# EAGLE design zone_ctrl (EAGLE 9.6.2)
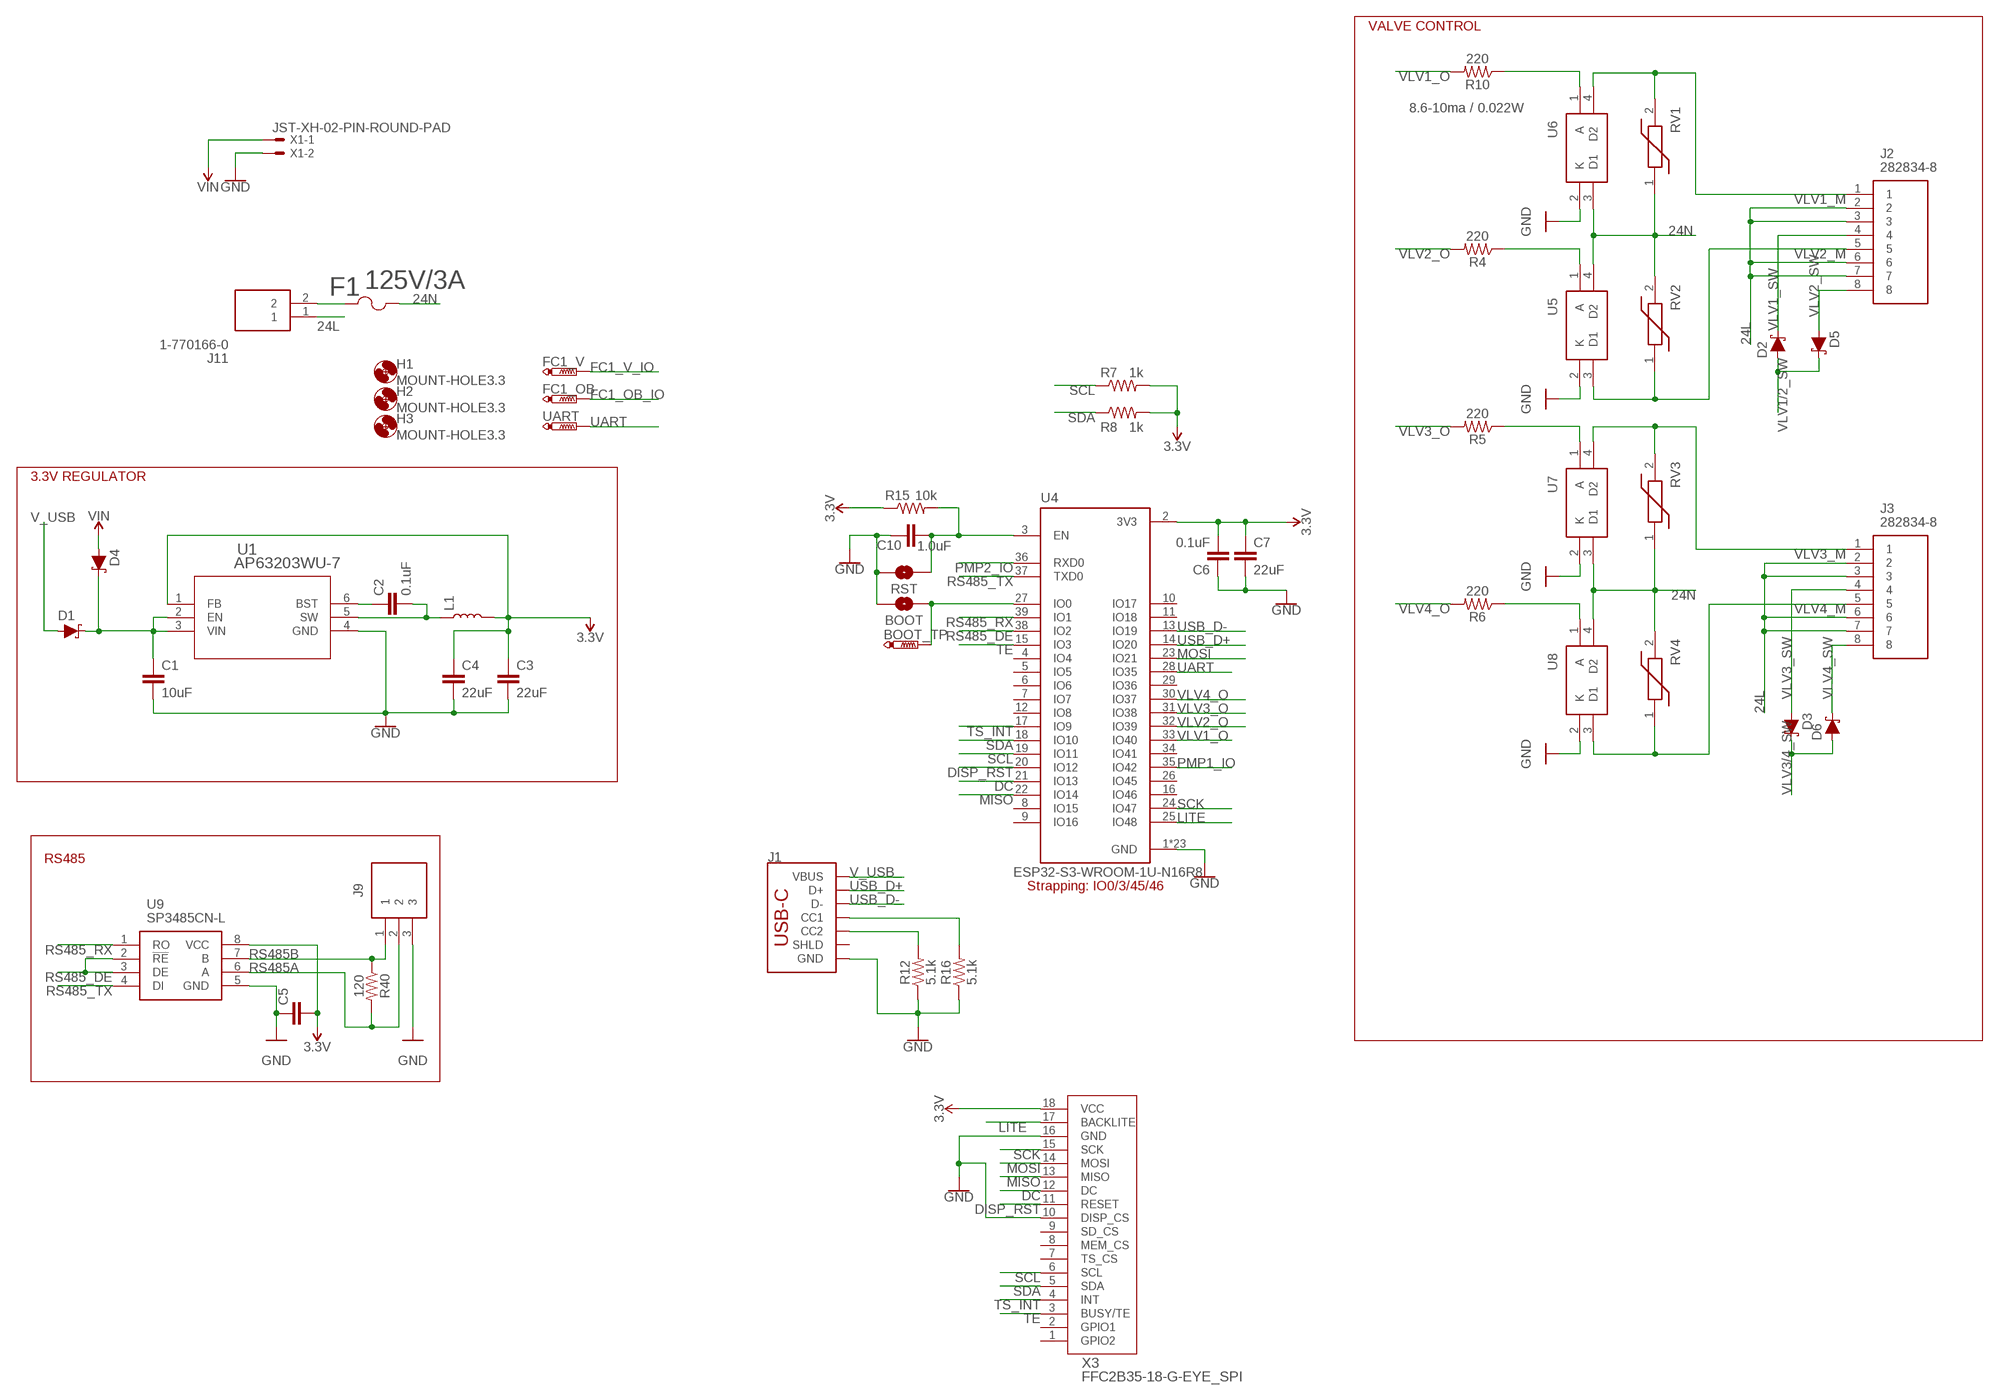
[diagram p0: schematic, sheet 1, part 1 of 2]
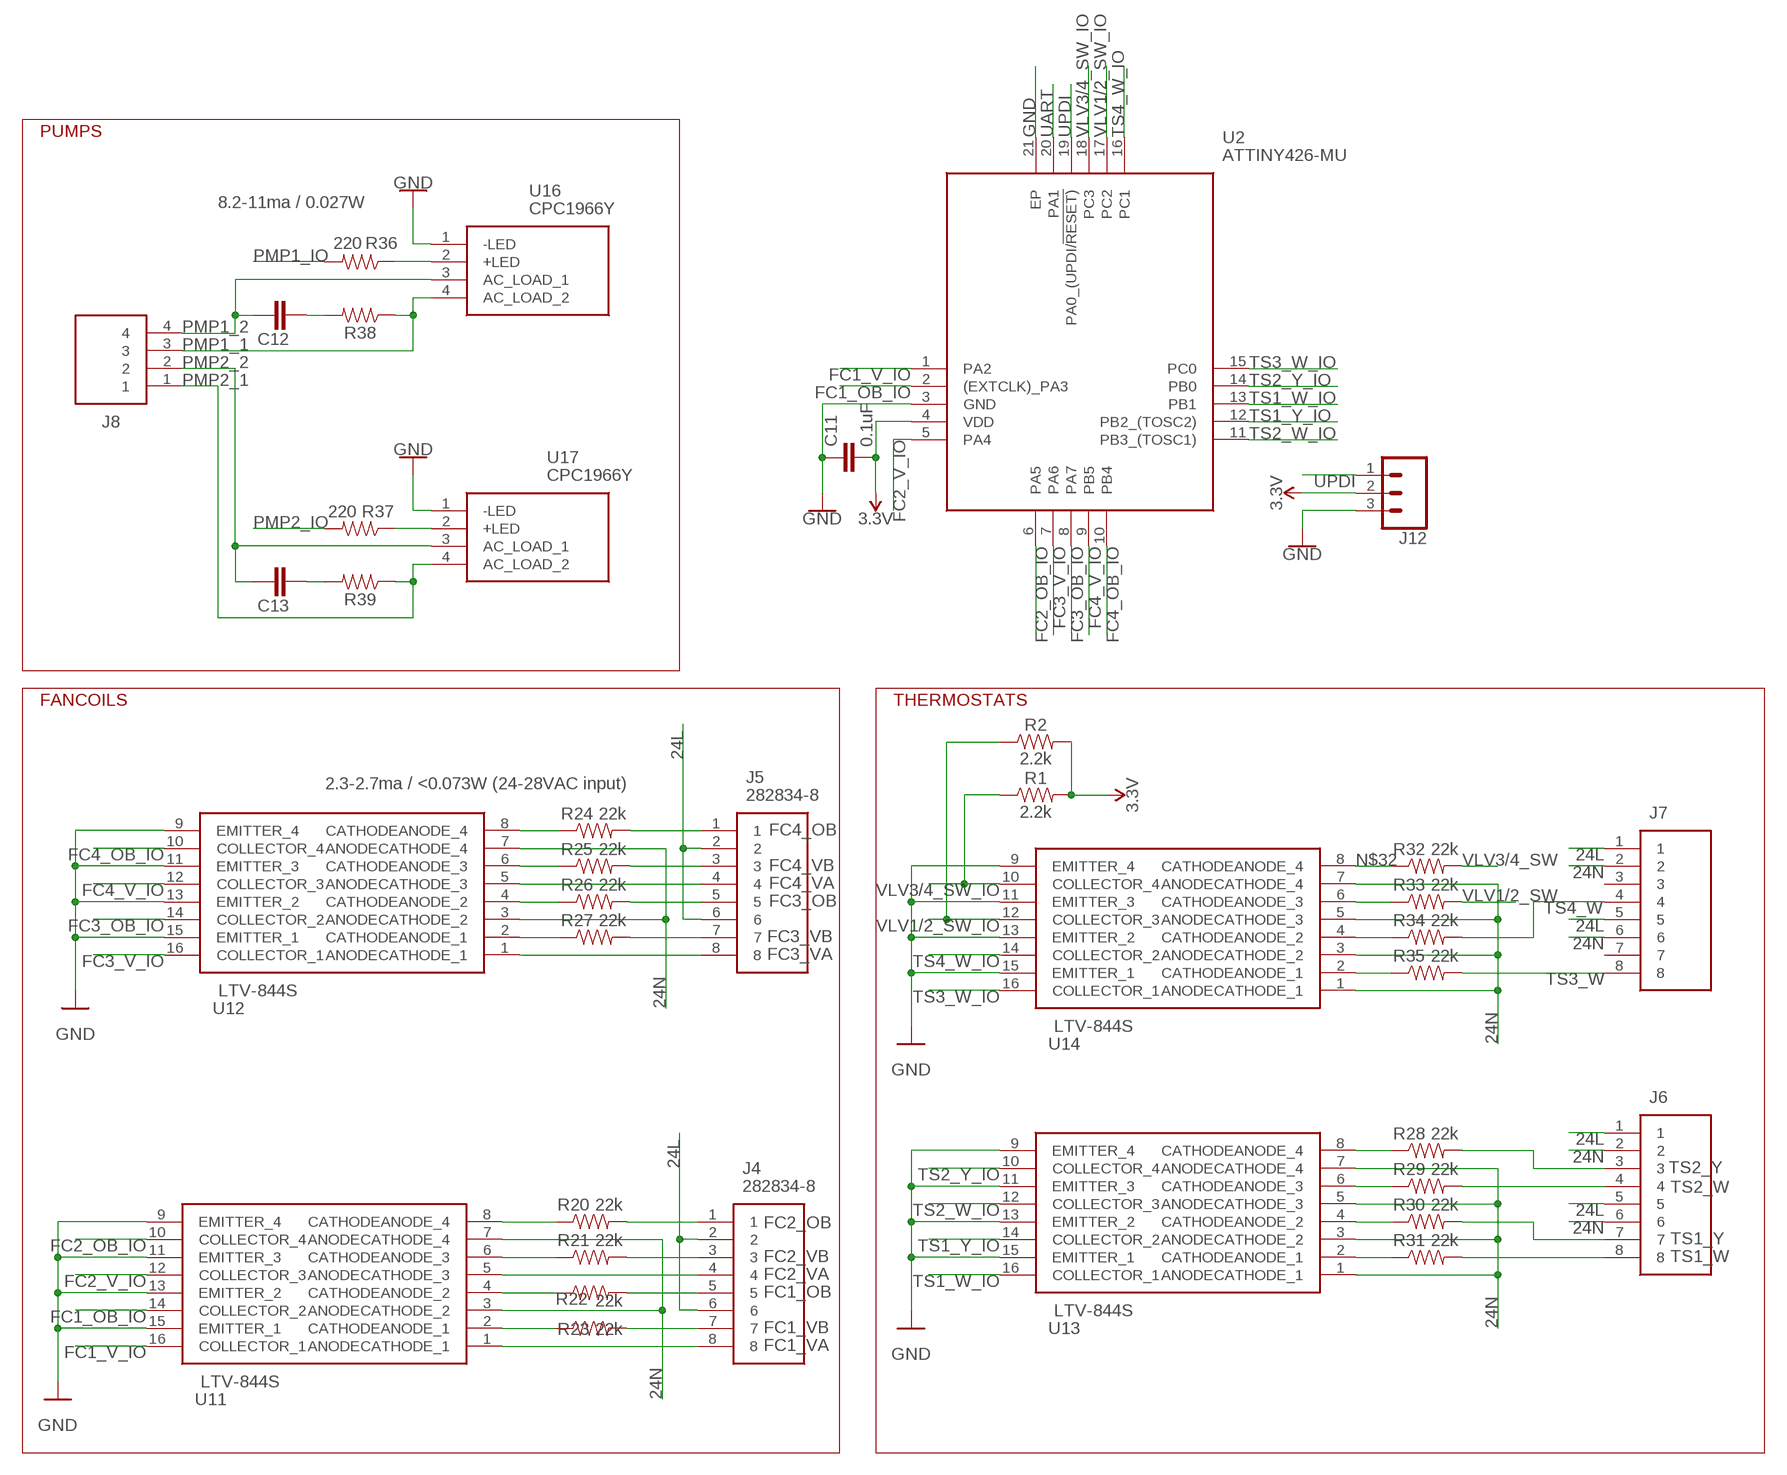
[diagram p1: schematic, sheet 1, part 2 of 2]

## Parts
BOOT  JUMPER-SMT_2_NO_NO-SILK  [SMT-JUMPER_2_NO_NO-SILK]
BOOT_TP  PTR1B1,27  [B1,27]
C1  10uF  10UF-1206-6.3V-20%  [1206]
C2  0.1uF  0.1UF-0603-25V-5%  [0603]
C3  22uF  22UF-0805-6.3V-20%  [0805]
C4  22uF  22UF-0805-6.3V-20%  [0805]
C5  0.1uF  0.1UF-0603-25V-5%  [0603]
C6  0.1uF  0.1UF-0603-25V-5%  [0603]
C7  22uF  22UF-0805-6.3V-20%  [0805]
C10  1.0uF  1.0UF-0603-16V-10%  [0603]
C11  0.1uF  0.1UF-0603-25V-5%  [0603]
C12  10nF  10NF-0805-400V-20%  [0805]
C13  10nF  10NF-0805-400V-20%  [0805]
D1  1A/23V/620mV  DIODE-SCHOTTKY-BAT20J  [SOD-323]
D2  1A/23V/620mV  DIODE-SCHOTTKY-BAT20J  [SOD-323]
D3  1A/23V/620mV  DIODE-SCHOTTKY-BAT20J  [SOD-323]
D4  1A/23V/620mV  DIODE-SCHOTTKY-BAT20J  [SOD-323]
D5  1A/23V/620mV  DIODE-SCHOTTKY-BAT20J  [SOD-323]
D6  1A/23V/620mV  DIODE-SCHOTTKY-BAT20J  [SOD-323]
F1  125V/3A  01550900M125V/3A/SLOW  [01550900M]
FC1_OB  PTR1B1,27  [B1,27]
FC1_V  PTR1B1,27  [B1,27]
H1  MOUNT-HOLE3.3  [3,3]
H2  MOUNT-HOLE3.3  [3,3]
H3  MOUNT-HOLE3.3  [3,3]
J1  USB_C_2-LAYER_PADS  [USB-C-16P-2LAYER-PADS]
J2  282834-8  [2828348]
J3  282834-8  [2828348]
J4  282834-8  [2828348]
J5  282834-8  [2828348]
J6  282834-8  [2828348]
J7  282834-8  [2828348]
J8  4DB-P108-04  [SHDR4W132P0X826_1X4_3467X1270X]
J9  282834-3  [2828343]
J11  1-770166-0  [17701660]
J12  455-1750-1-ND  CONN_03  [1X03]
L1  4.7μH_SHIELDED_INDUCTOR  [1008(2520)]
R1  2.2k  2.2KOHM-0603-1/10W-1%  [0603]
R2  2.2k  2.2KOHM-0603-1/10W-1%  [0603]
R4  220  220OHM-0603-1/10W-1%  [0603]
R5  220  220OHM-0603-1/10W-1%  [0603]
R6  220  220OHM-0603-1/10W-1%  [0603]
R7  1k  1KOHM-0603-1/10W-1%  [0603]
R8  1k  1KOHM-0603-1/10W-1%  [0603]
R10  220  220OHM-0603-1/10W-1%  [0603]
R12  5.1k  5.1KOHM5.1KOHM-0603-1/10W-1%  [0603]
R15  10k  10KOHM-0603-1/10W-1%  [0603]
R16  5.1k  5.1KOHM5.1KOHM-0603-1/10W-1%  [0603]
R20  22k  22KOHM-0603-1/10W-1%  [0603]
R21  22k  22KOHM-0603-1/10W-1%  [0603]
R22  22k  22KOHM-0603-1/10W-1%  [0603]
R23  22k  22KOHM-0603-1/10W-1%  [0603]
R24  22k  22KOHM-0603-1/10W-1%  [0603]
R25  22k  22KOHM-0603-1/10W-1%  [0603]
R26  22k  22KOHM-0603-1/10W-1%  [0603]
R27  22k  22KOHM-0603-1/10W-1%  [0603]
R28  22k  22KOHM-0603-1/10W-1%  [0603]
R29  22k  22KOHM-0603-1/10W-1%  [0603]
R30  22k  22KOHM-0603-1/10W-1%  [0603]
R31  22k  22KOHM-0603-1/10W-1%  [0603]
R32  22k  22KOHM-0603-1/10W-1%  [0603]
R33  22k  22KOHM-0603-1/10W-1%  [0603]
R34  22k  22KOHM-0603-1/10W-1%  [0603]
R35  22k  22KOHM-0603-1/10W-1%  [0603]
R36  220  220OHM-0603-1/10W-1%  [0603]
R37  220  220OHM-0603-1/10W-1%  [0603]
R38  100  100OHM-0805-1/10W-5%-400V  [0805]
R39  100  100OHM-0805-1/10W-5%-400V  [0805]
R40  120  120OHM-0603-1/10W-5%  [0603]
RST  JUMPER-SMT_2_NO_NO-SILK  [SMT-JUMPER_2_NO_NO-SILK]
RV1  ZV35K1210251NIR1  [VARC3225X145N]
RV2  ZV35K1210251NIR1  [VARC3225X145N]
RV3  ZV35K1210251NIR1  [VARC3225X145N]
RV4  ZV35K1210251NIR1  [VARC3225X145N]
U1  AP63203WU-7  [SOIC_05WU-7_DIO]
U2  ATTINY426-MU  [QFN40P300X300X90-21N]
U4  ESP32-S3-WROOM-1U-N16R8  [ESP32S3WROOM1UN16R8]
U5  G3VM-61VY3_TR_  [G3VM61VY3TR]
U6  G3VM-61VY3_TR_  [G3VM61VY3TR]
U7  G3VM-61VY3_TR_  [G3VM61VY3TR]
U8  G3VM-61VY3_TR_  [G3VM61VY3TR]
U9  SP3485CN-L  [SOIC127P600X175-8N]
U11  LTV-844S  [LTV846S]
U12  LTV-844S  [LTV846S]
U13  LTV-844S  [LTV846S]
U14  LTV-844S  [LTV846S]
U16  CPC1966Y  [CPC1966Y]
U17  CPC1966Y  [CPC1966Y]
UART  PTR1B1,27  [B1,27]
X1  JST-XH-02-PIN-ROUND-PAD  [JST-XH-02-PACKAGE-ROUND-PAD]
X3  FFC2B35-18-G-EYE_SPI  [FFC2B3518G]

## Nets
3.3V: C3.1 C4.1 C5.2 C6.2 C7.1 C11.2 J12.2 L1.2 R1.2 R2.2 R7.2 R8.2 R15.1 U1.1(FB) U2.4(VDD) U4.2(3V3) U9.8(VCC) X3.18(VCC)
24L [24VAC]: J2.2 J2.3 J2.6 J2.7 J3.2 J3.3 J3.6 J3.7 J4.2 J4.6 J5.2 J5.6 J6.1 J6.5 J7.1 J7.5 J11.1
24N [24VAC]: F1.2 J6.2 J6.6 J7.2 J7.6 RV1.1 RV2.2 RV3.1 RV4.2 U5.4(D2) U6.3(D1) U7.3(D1) U8.4(D2) U11.3(ANODECATHODE_2) U11.7(ANODECATHODE_4) U12.3(ANODECATHODE_2) U12.7(ANODECATHODE_4) U13.1(ANODECATHODE_1) U13.3(ANODECATHODE_2) U13.5(ANODECATHODE_3) U13.7(ANODECATHODE_4) U14.1(ANODECATHODE_1) U14.3(ANODECATHODE_2) U14.5(ANODECATHODE_3) U14.7(ANODECATHODE_4)
DC: U4.21(IO13) X3.12(DC)
DISP_RST: U4.20(IO12) X3.11(RESET)
FC1_OB: J4.5 R22.2
FC1_OB_IO: FC1_OB.TP U2.2((EXTCLK)_PA3) U11.14(COLLECTOR_2)
FC1_V_IO: FC1_V.TP U2.1(PA2) U11.16(COLLECTOR_1)
FC1_VA: J4.8 U11.1(ANODECATHODE_1)
FC1_VB: J4.7 R23.2
FC2_OB: J4.1 R20.2
FC2_OB_IO: U2.6(PA5) U11.10(COLLECTOR_4)
FC2_V_IO: U2.5(PA4) U11.12(COLLECTOR_3)
FC2_VA: J4.4 U11.5(ANODECATHODE_3)
FC2_VB: J4.3 R21.2
FC3_OB: J5.5 R26.2
FC3_OB_IO: U2.8(PA7) U12.14(COLLECTOR_2)
FC3_V_IO: U2.7(PA6) U12.16(COLLECTOR_1)
FC3_VA: J5.8 U12.1(ANODECATHODE_1)
FC3_VB: J5.7 R27.2
FC4_OB: J5.1 R24.2
FC4_OB_IO: U2.10(PB4) U12.10(COLLECTOR_4)
FC4_V_IO: U2.9(PB5) U12.12(COLLECTOR_3)
FC4_VA: J5.4 U12.5(ANODECATHODE_3)
FC4_VB: J5.3 R25.2
GND: BOOT.2 C1.2 C3.2 C4.2 C5.1 C6.1 C7.2 C10.1 C11.1 J1.GND J1.GND2(GND) J9.3 J12.3 R12.1 R16.1 RST.2 U1.4(GND) U2.3(GND) U2.21(EP) U4.1(GND) U4.40(GND) U4.41(GND) U4.41_10(GND) U4.41_11(GND) U4.41_12(GND) U4.41_13(GND) U4.41_14(GND) U4.41_15(GND) U4.41_16(GND) U4.41_17(GND) U4.41_18(GND) U4.41_19(GND) U4.41_20(GND) U4.41_21(GND) U4.42(GND) U4.43(GND) U4.44(GND) U4.45(GND) U4.46(GND) U4.47(GND) U4.48(GND) U4.49(GND) U5.2(K) U6.2(K) U7.2(K) U8.2(K) U9.5(GND) U11.9(EMITTER_4) U11.11(EMITTER_3) U11.13(EMITTER_2) U11.15(EMITTER_1) U12.9(EMITTER_4) U12.11(EMITTER_3) U12.13(EMITTER_2) U12.15(EMITTER_1) U13.9(EMITTER_4) U13.11(EMITTER_3) U13.13(EMITTER_2) U13.15(EMITTER_1) U14.9(EMITTER_4) U14.11(EMITTER_3) U14.13(EMITTER_2) U14.15(EMITTER_1) U16.1(-LED) U17.1(-LED) X1.2 X3.10(DISP_CS) X3.16(GND)
LITE: U4.25(IO48) X3.17(BACKLITE)
MISO: U4.22(IO14) X3.13(MISO)
MOSI: U4.23(IO21) X3.14(MOSI)
N$1: C2.2 L1.1 U1.5(SW)
N$2: C2.1 U1.6(BST)
N$3: BOOT.1 BOOT_TP.TP U4.27(IO0)
N$4: R20.1 U11.8(CATHODEANODE_4)
N$7: J1.A5(CC1) R16.2
N$9: C10.2 R15.2 RST.1 U4.3(EN)
N$10: R10.1 U6.1(A)
N$11: R4.1 U5.1(A)
N$12: R22.1 U11.4(CATHODEANODE_2)
N$13: R5.1 U7.1(A)
N$14: J1.B5(CC2) R12.2
N$15: R21.1 U11.6(CATHODEANODE_3)
N$16: R6.1 U8.1(A)
N$17: R23.1 U11.2(CATHODEANODE_1)
N$18: R24.1 U12.8(CATHODEANODE_4)
N$19: R25.1 U12.6(CATHODEANODE_3)
N$20: R26.1 U12.4(CATHODEANODE_2)
N$21: R27.1 U12.2(CATHODEANODE_1)
N$22: R28.1 U13.8(CATHODEANODE_4)
N$23: R29.1 U13.6(CATHODEANODE_3)
N$24: R30.1 U13.4(CATHODEANODE_2)
N$25: R31.1 U13.2(CATHODEANODE_1)
N$26: R35.1 U14.2(CATHODEANODE_1)
N$27: R34.1 U14.4(CATHODEANODE_2)
N$29: F1.1 J11.2
N$30: R33.1 U14.6(CATHODEANODE_3)
N$32: R32.1 U14.8(CATHODEANODE_4)
N$65: R37.1 U17.2(+LED)
N$66: R36.1 U16.2(+LED)
N$68 [HV]: C12.2 R38.2
N$72: C13.2 R39.2
PMP1_1 [HV]: J8.3 R38.1 U16.4(AC_LOAD_2)
PMP1_2 [HV]: C12.1 J8.4 U16.3(AC_LOAD_1)
PMP1_IO: R36.2 U4.35(IO42)
PMP2_1 [HV]: J8.1 R39.1 U17.4(AC_LOAD_2)
PMP2_2 [HV]: C13.1 J8.2 U17.3(AC_LOAD_1)
PMP2_IO: R37.2 U4.36(RXD0)
REG_IN: C1.1 D1.C D4.C U1.2(EN) U1.3(VIN)
RS485_DE: U4.38(IO2) U9.2(!RE) U9.3(DE)
RS485_RX: U4.39(IO1) U9.1(RO)
RS485_TX: U4.37(TXD0) U9.4(DI)
RS485A: J9.2 R40.2 U9.6(A)
RS485B: J9.1 R40.1 U9.7(B)
SCK: U4.24(IO47) X3.15(SCK)
SCL: R7.1 U4.19(IO11) X3.6(SCL)
SDA: R8.1 U4.18(IO10) X3.5(SDA)
TE: U4.15(IO3) X3.3(BUSY/TE)
TS1_W: J6.8 R31.2
TS1_W_IO: U2.13(PB1) U13.16(COLLECTOR_1)
TS1_Y: J6.7 R30.2
TS1_Y_IO: U2.12(PB2_(TOSC2)) U13.14(COLLECTOR_2)
TS2_W: J6.4 R29.2
TS2_W_IO: U2.11(PB3_(TOSC1)) U13.12(COLLECTOR_3)
TS2_Y: J6.3 R28.2
TS2_Y_IO: U2.14(PB0) U13.10(COLLECTOR_4)
TS3_W: J7.8 R35.2
TS3_W_IO: U2.15(PC0) U14.16(COLLECTOR_1)
TS4_W: J7.4 R34.2
TS4_W_IO: U2.16(PC1) U14.14(COLLECTOR_2)
TS_INT: U4.17(IO9) X3.4(INT)
UART: U2.20(PA1) U4.28(IO35) UART.TP
UPDI: J12.1 U2.19(PA0_(UPDI/!RESET))
USB_D+: J1.A6(D+) J1.B6(D+) U4.14(IO20)
USB_D-: J1.A7(D-) J1.B7(D-) U4.13(IO19)
V_USB: D1.A J1.VBUS1(VBUS) J1.VBUS2(VBUS)
VIN: D4.A X1.1
VLV1/2_SW: D2.A D5.C R33.2
VLV1/2_SW_IO: R2.1 U2.17(PC2) U14.12(COLLECTOR_3)
VLV1_M [24VAC]: J2.1 RV1.2 U6.4(D2)
VLV1_O: R10.2 U4.33(IO40)
VLV1_SW: D2.C J2.4
VLV2_M [24VAC]: J2.5 RV2.1 U5.3(D1)
VLV2_O: R4.2 U4.32(IO39)
VLV2_SW: D5.A J2.8
VLV3/4_SW: D3.C D6.A R32.2
VLV3/4_SW_IO: R1.1 U2.18(PC3) U14.10(COLLECTOR_4)
VLV3_M [24VAC]: J3.1 RV3.2 U7.4(D2)
VLV3_O: R5.2 U4.31(IO38)
VLV3_SW: D3.A J3.4
VLV4_M [24VAC]: J3.5 RV4.1 U8.3(D1)
VLV4_O: R6.2 U4.30(IO37)
VLV4_SW: D6.C J3.8
Unconnected: J1.SHLD1(SHLD) J1.SHLD2(SHLD) J1.SHLD3(SHLD) J1.SHLD4(SHLD) J7.3 J7.7 U4.4(IO4) U4.5(IO5) U4.6(IO6) U4.7(IO7) U4.8(IO15) U4.9(IO16) U4.10(IO17) U4.11(IO18) U4.12(IO8) U4.16(IO46) U4.26(IO45) U4.29(IO36) U4.34(IO41) X3.1(GPIO2) X3.2(GPIO1) X3.7(TS_CS) X3.8(MEM_CS) X3.9(SD_CS)

## Notes on the sheet
- VALVE CONTROL | PUMPS
- 8.2-11ma / 0.027W
- 8.6-10ma / 0.022W
- FANCOILS | THERMOSTATS
- 3.3V REGULATOR
- 2.3-2.7ma / <0.073W (24-28VAC input)
- RS485
- Strapping: IO0/3/45/46

## Library data of the parts
BOOT RST = SparkFun-Jumpers:JUMPER-SMT_2_NO: Normally open jumper This jumper has two pads in close proximity to each other. Apply solder to close the connection. Round pads are easier to solder for beginners, but are a lot larger. SparkFun Product that uses the round pads: SparkFun EL Sequencer <https://www.sparkfun.com/products/12781>
BOOT_TP FC1_OB FC1_V UART = testpad:PTR1: TEST PIN
C1 = SparkFun-Capacitors:10UF: 10.0µF ceramic capacitors A capacitor is a passive two-terminal electrical component used to store electrical energy temporarily in an electric field.; PROD_ID: CAP-10057
C2 C5 C6 C11 = SparkFun-Capacitors:0.1UF: 0.1µF ceramic capacitors A capacitor is a passive two-terminal electrical component used to store electrical energy temporarily in an electric field.; PROD_ID: CAP-08604
C3 C4 C7 = SparkFun-Capacitors:22UF: 22µF ceramic capacitors A capacitor is a passive two-terminal electrical component used to store electrical energy temporarily in an electric field.; PROD_ID: CAP-08402
C10 = SparkFun-Capacitors:1.0UF: 1µF ceramic capacitors A capacitor is a passive two-terminal electrical component used to store electrical energy temporarily in an electric field.; PROD_ID: CAP-00868
C12 C13 = Capacitors:10NF
D1-D6 = SparkFun-DiscreteSemi:DIODE-SCHOTTKY: Schottky diode A Schottky diode is a semiconductor diode which has a low forward voltage drop and a very fast switching action.; PROD_ID: DIO-11623
F1 = Littelfuse SMD holder 01550900M:01550900M: Fuse Block 10 A 125V 1 Circuit Cartridge Surface Mount Source: Datasheet <http://www.littelfuse.com/~/media/electronics/datasheets/fuses/littelfuse_fuse_154_154t_154l_154tl_datasheet.pdf.pdf>; DESCRIPTION: 125v/3A slow blow fuse in smd holder; MANUFACTURER_NAME: Littelfuse; MANUFACTURER_PART_NUMBER: 0154003.DRTL
H1-H3 = holes:MOUNT-HOLE: MOUNTING HOLE with drill center marker
J1 = SparkFun-Connectors:USB_C: USB Type C 16Pin Connector Super Speed pins not available on the 16-pin purely SMD connector so this part is best for USB 2.0 implementations. D1 and D2 are tied together enabling D+/- no matter which way the cable is plugged into the connector. The two channel configuration pins (CC1/2) are exposed. These are normally connected to ground via 5.1k resistors but can be reconfigured for high current/high power applications. **4-LAYER BOARD WARNING!!** If designing 4-layer board, make sure to select the variant _4-LAYER-ISOLATED. The linked footprint (USB-C-16-4LAYER-ISOLATED) includes some very necessary cutout polygons in the inner layers (2 and 15). This prevents the PTH mounting shield legs on the USB connector from electrically connecting any other polygons on the inner layers (usually VCC and GND).; PROD_ID: CONN-14122
J2-J7 = TE terminal block 282834-8:282834-8: TE Connectivity, Buchanan 2.54mm Pitch, 8 Way PCB Terminal Strip Source: Datasheet <https://www.te.com/commerce/DocumentDelivery/DDEController?Action=showdoc&DocId=Customer Drawing282834C1pdfEnglishENG_CD_282834_C1.pdf282834-9>; DESCRIPTION: TE Connectivity, Buchanan 2.54mm Pitch, 8 Way PCB Terminal Strip; HEIGHT: 10.3mm; MANUFACTURER_NAME: TE Connectivity; MANUFACTURER_PART_NUMBER: 282834-8; MOUSER_PART_NUMBER: 571-282834-8; MOUSER_PRICE-STOCK: https://www.mouser.co.uk/ProductDetail/TE-Connectivity/282834-8?qs=A%252Bip%252BNCYi6OmCuLnrGmJlA%3D%3D
J8 = TE barrier terminal 4DB-P108-04:4DB-P108-04: Conn Barrier Strip 4 POS 8.26mm Solder ST Thru-Hole Package Source: Datasheet <https://www.te.com/commerce/DocumentDelivery/DDEController?Action=srchrtrv&DocNm=2-1437667-4&DocType=Customer Drawing&DocLang=English>; DESCRIPTION: Conn Barrier Strip 4 POS 8.26mm Solder ST Thru-Hole Package; HEIGHT: 13.462mm; MANUFACTURER_NAME: TE Connectivity; MANUFACTURER_PART_NUMBER: 4DB-P108-04; MOUSER_PART_NUMBER: 571-214376676; MOUSER_PRICE-STOCK: https://www.mouser.co.uk/ProductDetail/TE-Connectivity/4DB-P108-04?qs=JZD3Rbs9XzlqoR88q1UQbw%3D%3D
J9 = Terminals and sockets:282834-3: Connector pcb 3 way 2.54mm Termi-Block Source: Datasheet <https://www.te.com/commerce/DocumentDelivery/DDEController?Action=showdoc&DocId=Customer Drawing282834C1pdfEnglishENG_CD_282834_C1.pdf282834-3>; DESCRIPTION: Connector pcb 3 way 2.54mm Termi-Block; HEIGHT: 10mm; MANUFACTURER_NAME: TE Connectivity; MANUFACTURER_PART_NUMBER: 282834-3; MOUSER_PART_NUMBER: 571-2828343; MOUSER_PRICE-STOCK: https://www.mouser.co.uk/ProductDetail/TE-Connectivity/282834-3?qs=A%252Bip%252BNCYi6M69kAjqV38yA%3D%3D
J11 = Terminals and sockets:1-770166-0: 2w Vertical pin header Tin TE Connectivity MATE-N-LOK Series, 4.14mm Pitch 2 Way Straight Heavy Duty Power Connector, Solder Termination, 9.5A Source: Datasheet <https://www.te.com/commerce/DocumentDelivery/DDEController?Action=showdoc&DocId=Customer Drawing770166MpdfEnglishENG_CD_770166_M.pdf1-770166-0>; DESCRIPTION: 2w Vertical pin header Tin TE Connectivity MATE-N-LOK Series, 4.14mm Pitch 2 Way Straight Heavy Duty Power Connector, Solder Termination, 9.5A; HEIGHT: 14.25mm; MANUFACTURER_NAME: TE Connectivity; MANUFACTURER_PART_NUMBER: 1-770166-0; MOUSER_PART_NUMBER: 571-1-770166-0; MOUSER_PRICE-STOCK: https://www.mouser.co.uk/ProductDetail/TE-Connectivity-AMP/1-770166-0?qs=m8myXnDJXpW%252BZqFFniy0cw%3D%3D
J12 = SparkFun-Connectors:CONN_03: Multi connection point. Often used as Generic Header-pin footprint for 0.1 inch spaced/style header connections On any of the 0.1 inch spaced packages, you can populate with these: Break Away Headers - Straight <https://www.sparkfun.com/products/116> (PRT-00116) Break Away Male Headers - Right Angle <https://www.sparkfun.com/products/553> (PRT-00553) Female Headers <https://www.sparkfun.com/products/115> (PRT-00115) Break Away Headers - Machine Pin <https://www.sparkfun.com/products/117> (PRT-00117) Break Away Female Headers - Swiss Machine Pin <https://www.sparkfun.com/products/743> (PRT-00743) Stackable Header - 3 Pin (Female, 0.1") <https://www.sparkfun.com/products/13875> (PRT-13875) For SCREWTERMINALS and SPRING TERMINALS visit here: Screw Terimnals on SparkFun.com <https://www.sparkfun.com/search/results?term=Screw+Terminals> (5mm/3.5mm/2.54mm spacing) This device is also useful as a general connection point to wire up your design to another part of your project. Our various solder wires solder well into these plated through hole pads. Hook-Up Wire - Assortment (Stranded, 22 AWG) <https://www.sparkfun.com/products/11375> (PRT-11375) Hook-Up Wire - Assortment (Solid Core, 22 AWG) <https://www.sparkfun.com/products/11367> (PRT-11367) View the entire wire category on our website here <https://www.sparkfun.com/categories/141> Special notes: Molex polarized connector foot print use with SKU : PRT-08232 with associated crimp pins and housings.; PROD_ID: XXX-00000
L1 = SparkFun-Coils:4.7μH_SHIELDED_INDUCTOR: 4.7uH Inductor 4.7uH 1.4A 50mOhm 1008(2520) Package Shielded; PROD_ID: NDUC-14880
R1 R2 = SparkFun-Resistors:2.2KOHM: 2.2kΩ resistor A resistor is a passive two-terminal electrical component that implements electrical resistance as a circuit element. Resistors act to reduce current flow, and, at the same time, act to lower voltage levels within circuits. - Wikipedia; PROD_ID: RES-08272
R4-R6 R10 R36 R37 = SparkFun-Resistors:220OHM: 220Ω resistor A resistor is a passive two-terminal electrical component that implements electrical resistance as a circuit element. Resistors act to reduce current flow, and, at the same time, act to lower voltage levels within circuits. - Wikipedia; PROD_ID: RES-07861
R7 R8 = SparkFun-Resistors:1KOHM: 1kΩ resistor A resistor is a passive two-terminal electrical component that implements electrical resistance as a circuit element. Resistors act to reduce current flow, and, at the same time, act to lower voltage levels within circuits. - Wikipedia; PROD_ID: RES-07856
R12 R16 = SparkFun-Resistors:5.1KOHM; PROD_ID: RES-12083
R15 = SparkFun-Resistors:10KOHM: 10kΩ resistor A resistor is a passive two-terminal electrical component that implements electrical resistance as a circuit element. Resistors act to reduce current flow, and, at the same time, act to lower voltage levels within circuits. - Wikipedia; PROD_ID: RES-00824
R20-R35 = SparkFun-Resistors:22KOHM: 22kΩ resistor A resistor is a passive two-terminal electrical component that implements electrical resistance as a circuit element. Resistors act to reduce current flow, and, at the same time, act to lower voltage levels within circuits. - Wikipedia; PROD_ID: RES-07853
R38 R39 = Resistors:100OHM
R40 = Resistors:120OHM
RV1-RV4 = Bourns Varistor ZV35K1210251NIR1:ZV35K1210251NIR1: Varistors ZV 35V 10% Source: Datasheet <https://g.componentsearchengine.com/Datasheets/2/ZV60K1210251NIR1HT.pdf>; DESCRIPTION: Varistors ZV 35V 10%; HEIGHT: 1.45mm; MANUFACTURER_NAME: Bourns; MANUFACTURER_PART_NUMBER: ZV35K1210251NIR1; MOUSER_PART_NUMBER: 652-ZV35K1210251NIR1; MOUSER_PRICE-STOCK: https://www.mouser.co.uk/ProductDetail/Bourns/ZV35K1210251NIR1?qs=GBLSl2AkirutxOaOmtSxyA%3D%3D
U1 = Diodes buck converter:AP63203WU-7; COPYRIGHT: Copyright (C) 2023 Ultra Librarian. All rights reserved.; MANUFACTURER_PART_NUMBER: AP63203WU-7; MFR_NAME: Diodes Inc
U2 = ATTINY426-MU:ATTINY426-MU: 8-bit Microcontrollers - MCU 20MHz, 4KB,VQFN20, Ind 85C, Green Source: Datasheet <https://www.microchip.com/content/dam/mchp/documents/MCU08/ProductDocuments/DataSheets/ATtiny424-426-427-824-826-827-DataSheet-DS40002311A.pdf>; DESCRIPTION: 8-bit Microcontrollers - MCU 20MHz, 4KB,VQFN20, Ind 85C, Green; HEIGHT: 0.9mm; MANUFACTURER_NAME: Microchip; MANUFACTURER_PART_NUMBER: ATTINY426-MU; MOUSER_PART_NUMBER: 579-ATTINY426-MU; MOUSER_PRICE-STOCK: https://www.mouser.co.uk/ProductDetail/Microchip-Technology/ATTINY426-MU?qs=pUKx8fyJudAatJqFKBSQfg%3D%3D
U4 = ESP32:ESP32-S3-WROOM-1U-N16R8: WiFi Modules - 802.11 [Engineering Samples] SMD Module, ESP32-S3R8, 8 MB Octal PSRAM Die, 16 MB Quad SPI Flash, IPEX Antenna Connector Source: Datasheet <https://www.espressif.com/sites/default/files/documentation/esp32-s3-wroom-1_wroom-1u_datasheet_en.pdf>; DESCRIPTION: WiFi Modules - 802.11 [Engineering Samples] SMD Module, ESP32-S3R8, 8 MB Octal PSRAM Die, 16 MB Quad SPI Flash, IPEX Antenna Connector; HEIGHT: 3.35mm; MANUFACTURER_NAME: Espressif Systems; MANUFACTURER_PART_NUMBER: ESP32-S3-WROOM-1U-N16R8; MOUSER_PART_NUMBER: 356-ESP32S3WM1UN16R8; MOUSER_PRICE-STOCK: https://www.mouser.co.uk/ProductDetail/Espressif-Systems/ESP32-S3-WROOM-1U-N16R8?qs=Li%252BoUPsLEns6V0Pr5KRJtw%3D%3D
U5-U8 = Omron SSR G3VM-61VY3_TR_:G3VM-61VY3_TR_: Solid State Relays - PCB Mount MOSFET Relay SOP4 60V 700mA 1 Form A Source: Datasheet <https://www.arrow.com/en/products/g3vm-61vy3-tr/omron>; DESCRIPTION: Solid State Relays - PCB Mount MOSFET Relay SOP4 60V 700mA 1 Form A; HEIGHT: 2.5mm; MANUFACTURER_NAME: Omron Electronics; MANUFACTURER_PART_NUMBER: G3VM-61VY3(TR); MOUSER_PART_NUMBER: 653-G3VM-61VY3TR; MOUSER_PRICE-STOCK: https://www.mouser.co.uk/ProductDetail/Omron-Electronics/G3VM-61VY3TR?qs=F5EMLAvA7IDWDr%252BrEjvwmw%3D%3D
U9 = MaxLinear RS485 SP3485CN-L:SP3485CN-L: Transceiver RS-485 3.3V 10Mbps SOIC8 EXAR SP3485CN-L, Line Transceiver, RS-422, RS-485, 3.3 V, 8-Pin SOIC Source: Datasheet <https://componentsearchengine.com/Datasheets/1/SP3485CN-L.pdf>; DESCRIPTION: Transceiver RS-485 3.3V 10Mbps SOIC8 EXAR SP3485CN-L, Line Transceiver, RS-422, RS-485, 3.3 V, 8-Pin SOIC; HEIGHT: 1.75mm; MANUFACTURER_NAME: EXAR; MANUFACTURER_PART_NUMBER: SP3485CN-L; MOUSER_PART_NUMBER: 701-SP3485CN-L; MOUSER_PRICE-STOCK: https://www.mouser.com/Search/Refine.aspx?Keyword=701-SP3485CN-L
U11-U14 = LiteOn AC optoisolator LTV-844S:LTV-844S: Lite-On LTV-844S AC Input Transistor Output Quad Optocoupler, Surface Mount, 16-Pin PDIP Source: Datasheet <https://optoelectronics.liteon.com/upload/download/DS-70-96-0013/LTV-8X4 series 201509.pdf>; DESCRIPTION: Lite-On LTV-844S AC Input Transistor Output Quad Optocoupler, Surface Mount, 16-Pin PDIP; HEIGHT: 4.6mm; MANUFACTURER_NAME: Lite-On; MANUFACTURER_PART_NUMBER: LTV-844S; MOUSER_PART_NUMBER: 859-LTV-844S; MOUSER_PRICE-STOCK: https://www.mouser.co.uk/ProductDetail/Lite-On/LTV-844S?qs=pF6wmZEQIu8hE2nMiDPc0g%3D%3D
U16 U17 = IXYS optotriac CPC1966Y:CPC1966Y: IXYS 3 A rms SPNO Solid State Relay, Zero Crossing, PCB Mount SCR, 240 V ac Maximum Load Source: Datasheet <https://datasheet.datasheetarchive.com/originals/distributors/Datasheets_SAMA/4bd38bcd53ac06cbf93d43ee226943fd.pdf>; DESCRIPTION: IXYS 3 A rms SPNO Solid State Relay, Zero Crossing, PCB Mount SCR, 240 V ac Maximum Load; HEIGHT: 10mm; MANUFACTURER_NAME: LITTELFUSE; MANUFACTURER_PART_NUMBER: CPC1966Y; MOUSER_PART_NUMBER: 849-CPC1966Y; MOUSER_PRICE-STOCK: https://www.mouser.co.uk/ProductDetail/IXYS-Integrated-Circuits/CPC1966Y?qs=8uBHJDVwVqxNfAOiNv29Iw%3D%3D
X1 = Rembrandt Electronics - JST XH Connectors v1-0:JST-XH-02-PIN: JST XH Connector 2 Pin Wire to board connector. Pitch: 2,54 mm, (0.100") Number of pins: 2 Created by Rembrandt Electronics www.rembrandtelectronics.com
X3 = GCT FFC2B35-18-G:FFC2B35-18-G-EYE_SPI: FFC & FPC Connectors .5mm SideEntry Flat Flex Cbl Conn 18P Au Source: Datasheet; DESCRIPTION: FFC & FPC Connectors .5mm SideEntry Flat Flex Cbl Conn 18P Au; HEIGHT: 2.2mm; MANUFACTURER_NAME: GCT (GLOBAL CONNECTOR TECHNOLOGY); MANUFACTURER_PART_NUMBER: FFC2B35-18-G; MOUSER_PART_NUMBER: 640-FFC2B35-18-G; MOUSER_PRICE-STOCK: https://www.mouser.co.uk/ProductDetail/GCT/FFC2B35-18-G?qs=Li%252BoUPsLEntRHHb6c10PFg%3D%3D

## Net classes
1 HV: width 0.508 mm, clearance 0.508 mm to class 0, clearance 0.508 mm
2 24VAC: clearance 0.381 mm to class 0, clearance 0.381 mm to class 1, clearance 0.381 mm

## Board
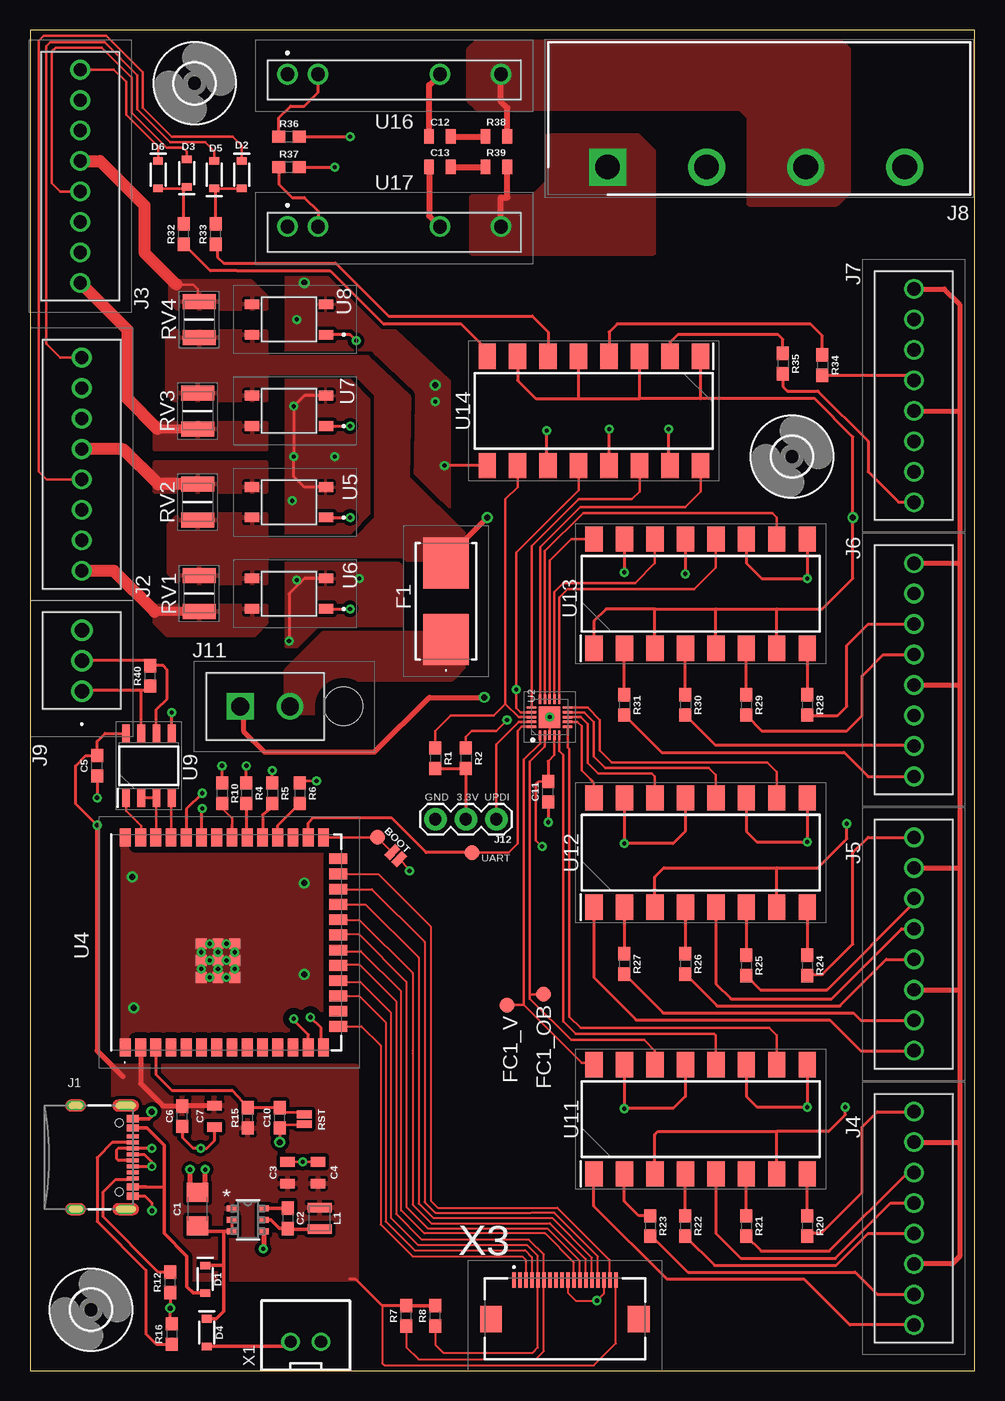
[diagram p2: board, top side]
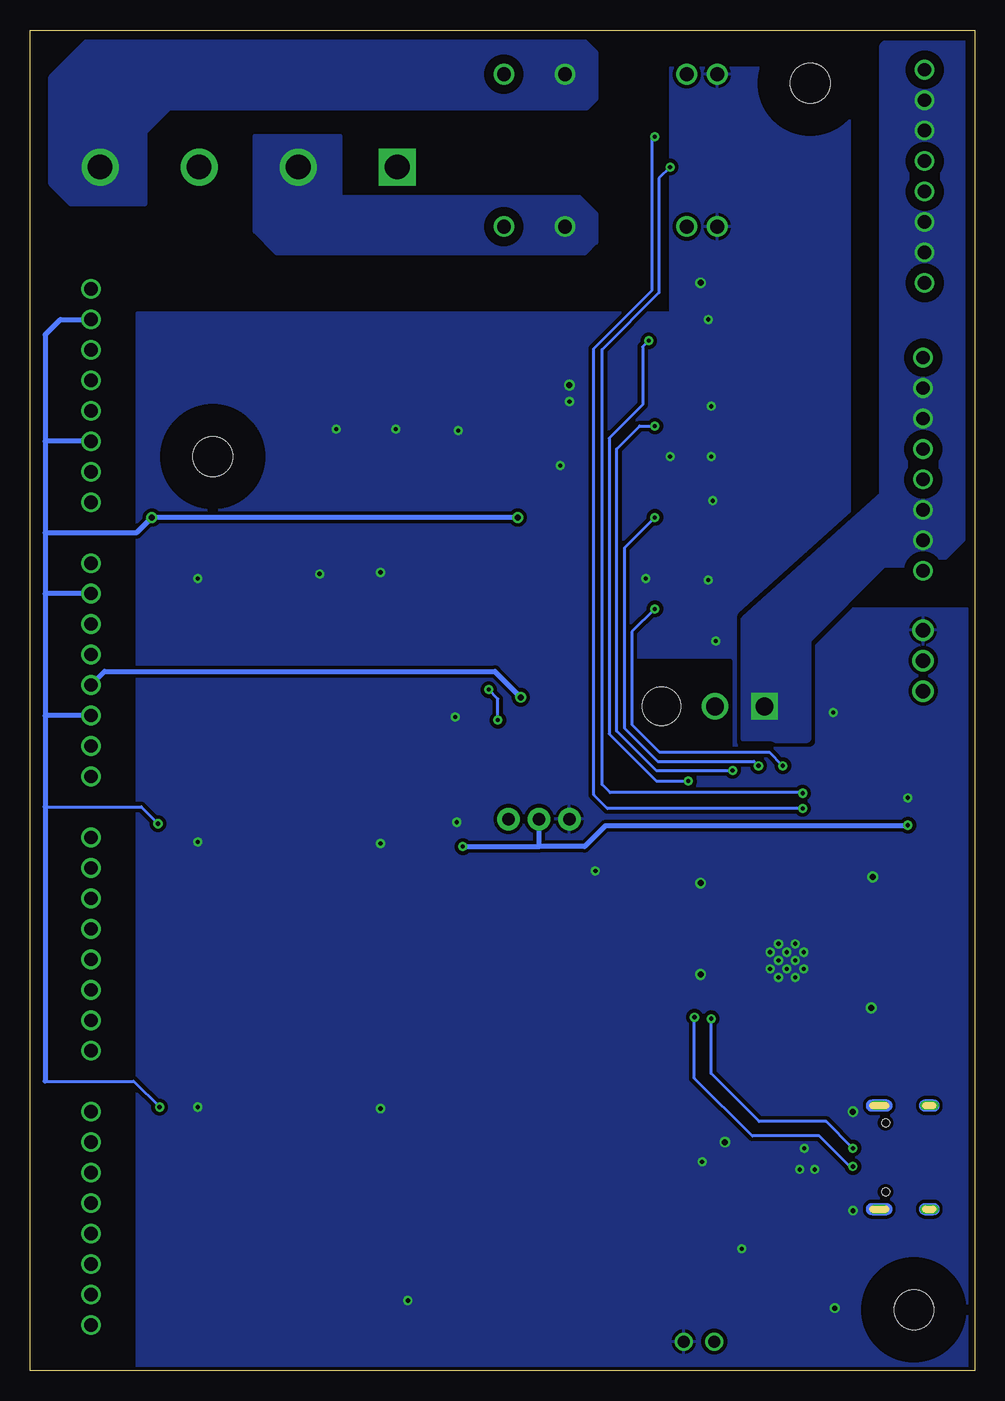
[diagram p3: board, bottom side, seen from below]

Size 78.74 x 111.76 mm. Coordinates in mm from the lower left corner, seen from the top.
Outline: 0,0 78.74,0 78.74,111.76 0,111.76 0,0
Copper layers (1*16): Top 0.035mm / dielectric 1.6mm / Bottom 0.035mm
Design rules "custom_jlcpcb_2layer *": minimum track width 5mil, minimum drill 12mil, track to track 5mil, track to pad 5mil, pad to pad 5mil, via to via 20mil, smd to smd 0mil, copper to edge 0.3mm, drill to drill 0.5mm, minimum pad ring 8mil, minimum via ring 8mil, stop-mask expansion 0mil, vias tented up to drill 100mil, thermal gap 10mil
tKeepout: area 28.6,88.8 to 78.7,111.4

### Footprints (pad centres in the part's own frame; a part is rotated, then mirrored left to right if it is on the bottom)
SMT-JUMPER_2_NO_NO-SILK = smd 0.635 x 1.27: 1 -0.406,0; 2 0.406,0
B1,27 = smd 1.27 x 1.27: TP 0,0
1206 = smd 1.6 x 1.8: 1 -1.4,0; 2 1.4,0
0603 = smd 1.1 x 1: 1 -0.85,0; 2 0.85,0
0805 = smd 0.8 x 1.2: 1 -0.9,0; 2 0.9,0
SOD-323 = smd 0.63 x 0.83: A 1.15,0; C -1.15,0
01550900M = smd 4.24 x 3.81: 1 -3.19,0; 2 3.19,0
3,3 = hole 3.3: 0,0
USB-C-16P-2LAYER-PADS = smd 0.3 x 1: A5 -1.25,-0.34; A6 -0.25,-0.34; A7 0.25,-0.34; A8 1.25,-0.34; B5 1.75,-0.34; B6 0.75,-0.34; B7 -0.75,-0.34; B8 -1.75,-0.34 | smd 0.6 x 1: GND -3.225,-0.34; GND2 3.225,-0.34; VBUS1 -2.45,-0.34; VBUS2 2.45,-0.34 | drill 0.4 pad 0.6 long: SHLD1 -4.318,-0.915; SHLD2 4.318,-0.915; SHLD3 -4.318,-5.095; SHLD4 4.318,-5.095 | hole 0.65: -2.89,-1.445; 2.89,-1.445
2828348 = drill 1.1 pad 1.65: 1 0,0; 2 2.54,0; 3 5.08,0; 4 7.62,0; 5 10.16,0; 6 12.7,0; 7 15.24,0; 8 17.78,0
SHDR4W132P0X826_1X4_3467X1270X = drill 2.05 pad 3.075 square: 1 0,0 | drill 2.05 pad 3.075: 2 8.255,0; 3 16.51,0; 4 24.765,0
2828343 = drill 1.2 pad 1.8: 1 0,0; 2 2.54,0; 3 5.08,0
17701660 = drill 1.48 pad 2.22 square: 1 0,0 | drill 1.48 pad 2.22: 2 4.14,0 | hole 3.18: 8.59,0
1X03 = drill 1.016 pad 1.88: 1 0,0; 2 2.54,0; 3 5.08,0
1008(2520) = smd 0.8 x 2: 1 -0.9,0; 2 0.9,0
VARC3225X145N = smd 1.25 x 2.75: 1 -1.5,0; 2 1.5,0
SOIC_05WU-7_DIO = smd 0.902 x 0.508: 1 -1.302,0.95; 2 -1.302,0; 3 -1.302,-0.95; 4 1.302,-0.95; 5 1.302,0; 6 1.302,0.95
QFN40P300X300X90-21N = smd 0.8 x 0.2: 1 -1.5,0.8; 2 -1.5,0.4; 3 -1.5,0; 4 -1.5,-0.4; 5 -1.5,-0.8; 11 1.5,-0.8; 12 1.5,-0.4; 13 1.5,0; 14 1.5,0.4; 15 1.5,0.8 | smd 0.2 x 0.8: 6 -0.8,-1.5; 7 -0.4,-1.5; 8 0,-1.5; 9 0.4,-1.5; 10 0.8,-1.5; 16 0.8,1.5; 17 0.4,1.5; 18 0,1.5; 19 -0.4,1.5; 20 -0.8,1.5 | smd 1.8 x 1.8: 21 0,0
ESP32S3WROOM1UN16R8 = smd 1.5 x 0.9: 1 -8.75,5.26; 2 -8.75,3.99; 3 -8.75,2.72; 4 -8.75,1.45; 5 -8.75,0.18; 6 -8.75,-1.09; 7 -8.75,-2.36; 8 -8.75,-3.63; 9 -8.75,-4.9; 10 -8.75,-6.17; 11 -8.75,-7.44; 12 -8.75,-8.71; 13 -8.75,-9.98; 14 -8.75,-11.25; 27 8.75,-11.25; 28 8.75,-9.98; 29 8.75,-8.71; 30 8.75,-7.44; 31 8.75,-6.17; 32 8.75,-4.9; 33 8.75,-3.63; 34 8.75,-2.36; 35 8.75,-1.09; 36 8.75,0.18; 37 8.75,1.45; 38 8.75,2.72; 39 8.75,3.99; 40 8.75,5.26 | smd 0.9 x 1.5: 15 -6.985,-12.5; 16 -5.715,-12.5; 17 -4.445,-12.5; 18 -3.175,-12.5; 19 -1.905,-12.5; 20 -0.635,-12.5; 21 0.635,-12.5; 22 1.905,-12.5; 23 3.175,-12.5; 24 4.445,-12.5; 25 5.715,-12.5; 26 6.985,-12.5 | smd 0.9 x 0.9: 41 -1.5,-2.46; 42 -1.5,-1.06; 43 -2.9,-1.06; 44 -2.9,-2.46; 45 -2.9,-3.86; 46 -1.5,-3.86; 47 -0.1,-3.86; 48 -0.1,-2.46; 49 -0.1,-1.06 | drill 0.35 pad 0.61: 41_10 -1.5,-1.76; 41_11 -2.9,-1.76; 41_12 -0.1,-1.76; 41_13 -2.9,-3.16; 41_14 -1.5,-3.16; 41_15 -0.1,-3.16; 41_16 -2.2,-1.06; 41_17 -0.8,-1.06; 41_18 -2.2,-2.46; 41_19 -0.8,-2.46; 41_20 -2.2,-3.86; 41_21 -0.8,-3.86
G3VM61VY3TR = smd 0.8 x 1.2: 1 -1.27,-3.075; 2 1.27,-3.075; 3 1.27,3.075; 4 -1.27,3.075
SOIC127P600X175-8N = smd 1.5 x 0.65: 1 -2.7,1.905; 2 -2.7,0.635; 3 -2.7,-0.635; 4 -2.7,-1.905; 5 2.7,-1.905; 6 2.7,-0.635; 7 2.7,0.635; 8 2.7,1.905
LTV846S = smd 2.1 x 1.45: 1 -4.55,8.89; 2 -4.55,6.35; 3 -4.55,3.81; 4 -4.55,1.27; 5 -4.55,-1.27; 6 -4.55,-3.81; 7 -4.55,-6.35; 8 -4.55,-8.89; 9 4.55,-8.89; 10 4.55,-6.35; 11 4.55,-3.81; 12 4.55,-1.27; 13 4.55,1.27; 14 4.55,3.81; 15 4.55,6.35; 16 4.55,8.89
CPC1966Y = drill 1.15 pad 1.725: 1 -8.89,0.123; 2 -6.35,0.123; 3 3.81,0.123; 4 8.89,0.123
JST-XH-02-PACKAGE-ROUND-PAD = drill 1.016: 1 -1.27,0; 2 1.27,0
FFC2B3518G = smd 0.3 x 1.3: 1 -4.25,1.198; 2 -3.75,1.198; 3 -3.25,1.198; 4 -2.75,1.198; 5 -2.25,1.198; 6 -1.75,1.198; 7 -1.25,1.198; 8 -0.75,1.198; 9 -0.25,1.198; 10 0.25,1.198; 11 0.75,1.198; 12 1.25,1.198; 13 1.75,1.198; 14 2.25,1.198; 15 2.75,1.198; 16 3.25,1.198; 17 3.75,1.198; 18 4.25,1.198 | smd 1.8 x 2.2: MP1 -6.15,-2.052; MP2 6.15,-2.052

### Placement (x,y rotation side)
BOOT  30.48,42.93 315 top
BOOT_TP  28.96,44.45 0 top
C1  13.97,13.46 90 top
C2  21.46,12.7 270 top
C3  21.46,16.51 90 top
C4  24,16.51 90 top
C5  5.59,50.42 90 top
C6  12.7,21.21 90 top
C7  15.37,21.21 270 top
C10  20.83,21.08 90 top
C11  43.18,48.26 90 top
C12  34.16,102.87 0 top
C13  34.16,100.33 0 top
D1  14.61,7.62 270 top
D2  17.65,99.69 270 top
D3  13.08,99.82 90 top
D4  14.73,3.17 270 top
D5  15.37,99.69 90 top
D6  10.67,99.69 270 top
F1  34.67,64.14 90 top
FC1_OB  42.8,31.37 0 top
FC1_V  39.75,30.48 0 top
H1  5.08,5.08 0 top
H2  13.72,107.31 0 top
H3  63.5,76.2 0 top
J1  8.89,17.78 270 top
J2  4.32,66.67 90 top
J3  4.19,90.68 90 top
J4  73.66,21.59 270 top
J5  73.66,44.45 270 top
J6  73.66,67.31 270 top
J7  73.66,90.17 270 top
J8  48.13,100.33 0 top
J9  4.32,56.64 90 top
J11  17.53,55.37 0 top
J12  38.86,45.97 180 top
L1  24.13,12.7 90 top
R1  33.78,51.05 270 top
R2  36.32,51.05 270 top
R4  18.03,48.13 270 top
R5  20.19,48.13 270 top
R6  22.48,48.13 270 top
R7  31.37,4.57 90 top
R8  33.78,4.57 90 top
R10  16,48.13 270 top
R12  11.68,7.37 90 top
R15  18.16,21.08 90 top
R16  11.81,3.05 270 top
R20  64.77,12.06 270 top
R21  59.69,12.06 270 top
R22  54.61,12.06 270 top
R23  51.69,12.06 270 top
R24  64.77,33.78 270 top
R25  59.69,33.78 270 top
R26  54.61,33.91 270 top
R27  49.53,33.91 270 top
R28  64.77,55.5 270 top
R29  59.69,55.5 270 top
R30  54.61,55.5 270 top
R31  49.53,55.5 270 top
R32  12.83,94.74 90 top
R33  15.49,94.74 90 top
R34  66.04,83.82 270 top
R35  62.74,83.95 270 top
R36  21.59,102.87 0 top
R37  21.59,100.33 0 top
R38  38.87,102.87 180 top
R39  38.87,100.33 180 top
R40  10.03,57.91 90 top
RST  22.86,20.95 270 top
RV1  14.1,64.77 270 top
RV2  13.97,72.39 270 top
RV3  13.97,80.01 270 top
RV4  14.1,87.63 270 top
U1  18.16,12.57 0 top
U2  43.31,54.48 90 top
U4  13.21,35.69 90 top
U5  21.59,72.39 90 top
U6  21.59,64.77 90 top
U7  21.59,80.01 90 top
U8  21.59,87.63 90 top
U9  9.91,50.42 90 top
U11  55.88,20.95 90 top
U12  55.88,43.18 90 top
U13  55.88,64.77 90 top
U14  46.99,80.01 270 top
U16  30.35,107.95 0 top
U17  30.35,95.25 0 top
UART  36.83,43.18 0 top
X1  22.99,2.41 0 top
X3  44.58,6.35 0 top

### Tracks (layer width: path | path; a pad name or v marks a point on that pad's centre or on a via)
3.3V  (via drill 0.35)
  Top 0.178: 48.83,7.11 X3.18 48.83,2.26 46.99,0.43 29.55,0.43 29.34,0.64 29.34,5.42
  Top 0.191: U2.4 43.71,51.33 | C11.2 42.38,49.11 42.16,48.9 42.16,44.2 v42.67,43.69
  Top 0.203: 43.71,51.33 43.18,50.8
  Top 0.254: C6.2 12.75,22.11 | 43.18,50.8 C11.2 | v5.59,45.47 3.81,47.24 3.81,50.42 4.66,51.27 C5.2 5.59,52.45 6.26,53.12 U9.8 | R1.2 R2.2 J12.2 | 26.67,7.62 27.14,7.62 29.34,5.42 R7.2
  Top 0.305: R8.2 R7.2
  Top 0.406: U4.2 9.22,23.93 11.09,22.06 C6.2 | 12.75,22.11 C7.1 | v5.59,45.47 5.59,26.67 7.75,24.51
  Bottom 0.406: v5.59,45.47 5.64,45.41 30.79,45.41 32.51,43.69 36.32,43.69 | 36.32,43.69 J12.2 | v42.67,43.69 36.32,43.69
  pour Top (isolate 0.305): 6.99,25.4 27.18,25.4 27.18,7.62 6.99,7.62
24L  (via drill 0.5)
  Top 0.406: 77.47,80.01 77.47,88.9 76.2,90.17 J7.1 | 77.47,80.01 77.47,67.31 | 77.47,67.31 77.47,57.15 | 77.47,57.15 77.47,41.91 | 77.47,41.91 77.47,31.75 | 77.47,31.75 77.47,19.05 | 77.47,19.05 77.47,9.53 76.83,8.89 J4.6 | J4.2 77.47,19.05 | J5.6 77.47,31.75 | J5.2 77.47,41.91 | J6.1 77.47,67.31 | J6.5 77.47,57.15 | J7.5 77.47,80.01 | J11.1 17.78,55.12 17.78,53.34 19.56,51.56 28.7,51.56 33.27,56.13 v37.85,56.13
  Bottom 0.406: v37.85,56.13 40.01,58.29 72.52,58.29 J6.5
  pour Bottom (isolate 0.762, no thermals): 0,110.49 7.49,110.49 7.62,110.36 7.62,72.94 19.18,62.57 19.18,52.7 13.97,52.7 13.97,60.96 7.62,67.31 3.17,67.31 0,70.48
  cutout Top (isolate 0.254): 13.72,59.18 20.7,59.18 20.7,53.85 24,53.85 25.53,55.37 28.7,55.37 28.7,51.56 13.72,51.56
24N  (via drill 0.35, 0.5)
  Top 0.254: U11.3 52.07,19.68 52.32,19.94 62.23,19.94 | 62.23,19.94 66.55,19.94 67.94,21.34 v67.94,21.97 | U11.7 62.23,19.94 | U12.3 52.07,41.15 52.83,41.91 62.23,41.91 | U12.7 62.23,41.91 | 62.23,41.91 65.66,41.91 68.07,44.32 v68.07,45.59 | U13.3 52.07,63.5 | 52.07,63.5 57.15,63.5 | 57.15,63.5 62.23,63.5 | 62.23,63.5 66.04,63.5 68.58,66.04 v68.58,71.12 68.58,77.84 65.4,81.03 55.86,81.03 | U13.5 57.15,63.5 | 52.07,63.5 48.01,63.5 46.99,62.48 U13.1 | U13.7 62.23,63.5 | U14.7 40.64,82.55 42.16,81.03 45.7,81.03 | 45.7,81.03 50.78,81.03 | 55.86,81.03 50.78,81.03 | U14.1 55.86,84.54 55.86,81.03 | U14.3 50.78,84.54 50.78,81.03 | U14.5 45.7,84.54 45.7,81.03
  Top 0.406: v38.1,71.12 35.56,68.58
  Bottom 0.254: v67.94,21.97 70.1,24.13 77.47,24.13 | 77.47,46.99 69.47,46.99 v68.07,45.59
  Bottom 0.406: 77.47,77.47 77.47,86.36 76.2,87.63 J7.2 | 77.47,77.47 77.47,69.85 | 77.47,69.85 77.47,64.77 | 77.47,64.77 77.47,54.61 | 77.47,54.61 77.47,46.99 77.47,24.13 | J7.6 77.47,77.47 | J6.2 77.47,64.77 | J6.6 77.47,54.61 | 77.47,69.85 69.85,69.85 v68.58,71.12 v38.1,71.12
  pour Top (isolate 0.381): 11.56,66.55 11.56,70.48 12.45,71.37 19.68,71.37 19.68,65.66 12.45,65.66
  pour Top (isolate 0.381): 19.68,80.9 12.06,80.9 11.43,81.53 11.43,85.98 12.06,86.61 19.68,86.61
  pour Top (isolate 0.762, no thermals): 18.67,84.33 27.98,84.33 31.39,81.13 31.28,74.38 36.2,69.47 36.2,65.66 33.66,65.66 31.24,68.07 18.41,68.07 18.41,69.09 27.18,69.09 29.08,70.99 29.08,81.41 27.18,83.31 18.67,83.31
DC
  Top 0.178: X3.12 45.83,9.14 43.1,11.86 33.15,11.86 31.37,13.64 31.37,32.41 27.43,36.35 25.74,36.35 U4.21
DISP_RST
  Top 0.178: U4.20 25.8,34.96 27.58,34.96 30.94,31.6 30.94,13.46 30.94,13.36 32.87,11.43 42.93,11.43 45.33,9.03 X3.11
FC1_OB
  Top 0.254: R22.2 57.06,8.76 67.18,8.76 69.85,11.43 J4.5
FC1_OB_IO
  Top 0.191: 41.66,31.37 41.66,50.8 42.91,52.05 U2.2 | 41.66,31.37 41.66,31 45.1,27.56 51.18,27.56 52.07,26.67 U11.14 | FC1_OB.TP 41.66,31.37
FC1_V_IO
  Top 0.191: U2.1 42.51,52.29 41.15,50.93 41.15,30.48 | 41.15,30.48 FC1_V.TP | 41.15,30.48 45.97,25.65 46.84,25.65 U11.16
FC1_VA
  Top 0.254: J4.8 68.33,3.81 64.52,7.62 53.09,7.62 46.99,13.72 U11.1
FC1_VB
  Top 0.254: R23.2 51.82,11.21 54.83,8.2 68.77,8.2 70.62,6.35 J4.7
FC2_OB
  Top 0.254: R20.2 65.05,11.5 65.97,11.5 69.34,14.87 69.34,20.32 70.61,21.59 J4.1
FC2_OB_IO
  Top 0.191: U2.6 44.81,51.97 44.96,51.82 44.96,29.5 45.88,28.57 61.59,28.57 62.23,27.94 U11.10
FC2_V_IO
  Top 0.191: U2.5 44.11,51.65 44.45,51.31 44.45,29.11 45.49,28.07 57.02,28.07 57.15,27.94 U11.12
FC2_VA
  Top 0.254: U11.5 57.15,11.43 59.23,9.35 67.12,9.35 71.74,13.97 J4.4
FC2_VB
  Top 0.254: R21.2 60.92,9.98 66.62,9.98 73.15,16.51 J4.3
FC3_OB
  Top 0.254: R26.2 57.27,30.4 67.49,30.4 71.37,34.29 J5.5
FC3_OB_IO
  Top 0.191: U2.8 45.9,54.48 46.48,53.9 46.48,50.67 47.37,49.78 51.82,49.78 52.07,49.53 U12.14
FC3_V_IO
  Top 0.191: U2.7 45.61,54.08 45.97,53.72 45.97,50.02 46.73,49.27 46.99,49 U12.16
FC3_VA
  Top 0.254: U12.1 46.99,32.77 50.52,29.23 66.65,29.23 69.22,26.67 J5.8
FC3_VB
  Top 0.254: R27.2 52.77,29.82 68.61,29.82 69.22,29.21 J5.7
FC4_OB
  Top 0.254: R24.2 64.86,33.02 66.04,33.02 68.58,35.56 68.58,43.18 69.85,44.45 J5.1
FC4_OB_IO
  Top 0.191: U2.10 46.46,55.28 47.5,54.25 47.5,51.69 48.49,50.7 61.44,50.7 62.23,49.91 U12.10
FC4_V_IO
  Top 0.191: U2.9 46.18,54.88 46.99,54.07 46.99,51.18 47.93,50.24 56.57,50.24 57.15,49.66 U12.12
FC4_VA
  Top 0.254: U12.5 57.15,32.26 58.42,30.99 66.8,30.99 72.64,36.83 J5.4
FC4_VB
  Top 0.254: R25.2 60.87,31.75 66.42,31.75 73.66,38.99 J5.3
GND  (via drill 0.35, 0.4, 0.5)
  Top 0.178: X3.10 44.83,6.48 45.47,5.84 v47.24,5.84 47.83,6.42 X3.16
  Top 0.191: U2.3 U2.21
  Top 0.203: BOOT.2 31.62,41.78 v31.62,41.66 | C3.2 v22.72,17.41 | v22.72,17.41 v22.73,17.4 | C4.2 v22.72,17.41 | C10.1 21.08,20.49 22.8,20.49 RST.2
  Top 0.254: C4.2 23.74,17.41 | J1.GND2 9.57,14.55 10.16,13.97 v10.16,13.34 | C10.1 v20.83,19.05 | U11.15 v49.53,21.84 53.59,21.84 54.61,22.86 U11.13 | U11.11 59.69,22.86 60.58,21.97 v64.77,21.97 U11.9 | C7.2 15.37,19.17 14.74,18.54 v14.22,18.54 13.59,18.54 12.7,19.43 C6.1 | C11.1 v43.18,45.72 | U13.15 v49.53,66.55 | U13.13 v54.61,66.42 | U13.11 59.69,67.31 60.96,66.04 v64.77,66.04 U13.9 | U14.11 43.05,75.59 v43.05,78.36 | U14.13 v48.26,78.49 | U14.15 53.21,75.59 v53.21,78.49 | U14.9 38.08,75.44 v34.54,75.44 | U7.2 22.86,81.28 v21.97,80.39 v21.97,76.2 21.97,74.55 22.86,73.66 U5.2 | U6.2 22.86,66.04 21.59,64.77 v21.59,60.83 | U12.15 v49.53,43.94 53.59,43.94 54.61,44.96 U12.13 | U12.11 59.69,44.96 60.58,44.07 v64.77,44.07 U12.9 | R16.1 11.68,4.03 v11.68,5.21 R12.1 | C5.1 v5.59,47.75 | U9.5 v11.81,54.86
  Top 0.305: J1.GND 9.96,21 10.16,21.21 v10.16,21.59
  Top 0.406: v13.34,16.76 13.34,15.5 C1.2 14.61,15.5 v14.61,16.76 | U1.4 19.46,10.19 v19.43,10.16
  other vias: 8.51,41.15 22.86,90.68 43.31,54.48 8.64,30.23 22.86,40.64 22.86,33.02 33.78,82.17 21.84,72.52 25.4,76.2 22.23,87.63 22.23,65.91 27.43,66.04 33.78,80.77
  pour Bottom (isolate 0.305, rank 2): 0.64,0 0.64,63.5 10.41,63.5 10.41,108.58 25.4,108.58 25.4,88.14 69.85,88.14 69.85,0
  pour Top (isolate 0.305, rank 2): 34.92,60.33 21.34,60.33 21.34,91.95 24.89,91.95 25.4,91.44 34.92,82.55
  pour Bottom (no thermals): 12.7,36.83 19.05,36.83 19.05,30.48 12.7,30.48
  cutout Top (isolate 0.254): 31.24,67.33 36.45,67.44 36.45,70.48 38.23,70.48 38.23,57.78 36.45,57.78 36.45,61.72 31.24,61.82
  cutout Bottom (isolate 0.254): 20.45,59.18 28.7,59.18 28.7,51.56 20.32,51.56 20.32,59.18
  pour Top (isolate 0.508, no thermals): 7.75,27.18 25.15,27.18 25.15,44.2 7.75,44.2
LITE
  Top 0.178: X3.17 48.33,9.2 43.94,13.59 33.96,13.59 33.4,14.15 33.4,37.01 29.01,41.4 U4.25
MISO
  Top 0.178: X3.13 46.33,9.3 43.33,12.29 33.43,12.29 31.88,13.84 31.88,26.42 31.88,26.67 31.88,33.15 27.43,37.59 U4.22
MOSI
  Top 0.178: X3.14 46.83,9.41 43.51,12.72 33.6,12.72 32.38,13.95 32.38,34.44 27.96,38.86 U4.23
N$1
  Top 0.305: U1.5 20.07,12.57 20.79,11.85 C2.2 21.51,11.8 L1.1
N$2
  Top 0.305: U1.6 19.49,13.55 C2.1
N$3
  Top 0.203: U4.27 BOOT_TP.TP BOOT.1 | BOOT.1
N$4
  Top 0.254: R20.1 U11.8
N$7
  Top 0.254: J1.A5 6.86,19.03 5.59,17.76 5.59,12.43 9.65,8.37 9.65,3.09 10.54,2.2 R16.2
N$9
  Top 0.203: C10.2 21.21,21.55 22.67,21.55 RST.1
  Top 0.254: U4.3 10.49,24.69 11.81,23.37 16.85,23.37 R15.2 C10.2
N$10  (via drill 0.35)
  Top 0.254: R10.1 v16,50.42 | U6.1 v26.67,63.5
  Bottom 0.254: v26.67,63.5 28.57,61.59 28.57,53.85 26.29,51.56 17.14,51.56 v16,50.42
N$11  (via drill 0.35)
  Top 0.254: U5.1 v26.67,71.12 | R4.1 v18.03,50.42
  Bottom 0.254: v26.67,71.12 29.21,68.58 29.21,53.58 26.43,50.8 18.41,50.8 v18.03,50.42
N$12
  Top 0.254: R22.1 U11.4
N$13  (via drill 0.35)
  Top 0.254: U7.1 v26.67,78.74 | R5.1 v20.19,50.04
  Bottom 0.254: v26.67,78.74 27.94,78.74 29.84,76.83 29.84,53.32 26.57,50.04 v20.19,50.04
N$14
  Top 0.254: J1.B5 8.43,15.91 7.11,15.91 6.1,14.9 6.1,12.83 10.71,8.22 R12.2
N$15
  Top 0.254: R21.1 U11.6
N$16  (via drill 0.35)
  Top 0.203: R6.1 22.64,49.15 v23.88,49.15
  Top 0.254: v27.18,85.85 26.67,86.36 U8.1
  Bottom 0.254: v27.18,85.85 27.69,85.34 27.69,80.52 30.48,77.72 30.48,53.09 26.54,49.15 v23.88,49.15
N$17
  Top 0.254: U11.2 49.53,14.12 50.73,12.91 R23.1
N$18
  Top 0.254: U12.8 R24.1
N$19
  Top 0.254: U12.6 R25.1
N$20
  Top 0.254: U12.4 R26.1
N$21
  Top 0.254: U12.2 R27.1
N$22
  Top 0.254: U13.8 R28.1
N$23
  Top 0.254: R29.1 U13.6
N$24
  Top 0.254: R30.1 U13.4
N$25
  Top 0.254: R31.1 U13.2
N$26
  Top 0.254: R35.1 62.74,85.98 62.36,86.36 53.98,86.36 53.34,85.72 U14.2
N$27
  Top 0.254: R34.1 66.04,86.26 65.06,87.25 48.92,87.25 48.26,86.59 U14.4
N$29
  pour Top (isolate 0.762, no thermals): 36.2,61.34 24.51,61.34 21.46,58.29 21.46,54.99 23.75,54.99 26.54,57.78 35.05,57.78 36.2,58.93
N$30
  Top 0.254: U14.6 43.18,86.59 41.87,87.91 29.89,87.91 25.47,92.33 16.13,92.33 15.62,92.84 15.62,93.77 R33.1
N$32
  Top 0.254: U14.8 38.1,85.07 35.94,87.23 29.49,87.23 25.02,91.69 17.78,91.69 17.23,91.69 15.03,91.69 R32.1
N$65
  Top 0.254: R37.1 20.74,98.89 21.84,97.79 22.86,97.79 24,96.65 U17.2
N$66
  Top 0.254: R36.1 20.74,104.43 21.72,105.41 22.86,105.41 24,106.55 U16.2
N$68
  Top 0.508: C12.2 R38.2
N$72
  Top 0.508: C13.2 R39.2
PMP1_1
  Top 0.508: R38.1 39.77,105.26 39.24,105.79 U16.4
  pour Top (isolate 0.762, no thermals): 68.2,98.3 68.2,110.11 67.44,110.87 37.34,110.87 36.58,110.11 36.58,105.92 37.21,105.28 59.18,105.28 59.94,104.52 59.94,97.28 67.18,97.28
PMP1_2
  Top 0.508: C12.1 33.26,107.17 U16.3
  pour Bottom (isolate 0.762, no thermals): 69.22,97.28 75.31,97.28 76.96,98.93 76.96,107.82 73.91,110.87 32.64,110.87 31.62,109.86 31.62,106.05 32.38,105.28 67.18,105.28 69.22,103.25
PMP1_IO  (via drill 0.35)
  Top 0.254: R36.2 v26.67,102.87 | U4.35 14.3,46.81 v14.35,46.86
  Bottom 0.254: v26.67,102.87 26.92,102.62 26.92,90.04 31.75,85.22 31.75,47.99 30.62,46.86 v14.35,46.86
PMP2_1
  Top 0.508: U17.4 39.24,97.79 39.75,97.79 39.77,97.81 R39.1
  pour Top (isolate 0.762, no thermals): 36.83,97.79 36.83,93.22 51.94,93.22 51.94,101.6 50.67,102.87 43.18,102.87 43.18,99.06 41.91,97.79
PMP2_2
  Top 0.508: C13.1 33.26,96.27 U17.3
  pour Bottom (isolate 0.762, no thermals): 52.96,97.79 33.02,97.79 31.62,96.39 31.62,94.11 32.51,93.22 58.17,93.22 59.94,95 59.94,102.87 52.96,102.87
PMP2_IO  (via drill 0.35)
  Top 0.254: R37.2 v25.4,100.33 | v14.35,48.13 13.03,46.81 U4.36
  Bottom 0.254: v25.4,100.33 26.34,99.39 26.34,89.85 31.06,85.13 31.06,48.84 30.41,48.19 14.4,48.19 v14.35,48.13
REG_IN
  Top 0.254: U1.3 U1.2
  Top 0.305: D4.C 15.5,4.33 16.13,4.95 16.13,8.76 | D1.C 16.12,8.77 16.13,8.76 | U1.3 16.13,11.62 | 16.13,11.62 13.77,11.62 C1.1 | 16.13,8.76 16.13,11.62
RS485_DE
  Top 0.203: U9.3 10.54,44.49 U4.38
  Top 0.254: U9.3 U9.2
RS485_RX
  Top 0.203: U4.39 9.26,44.48 9.26,45.41 8.92,45.75 8.44,46.23 8,46.67 U9.1
RS485_TX
  Top 0.203: U9.4 11.76,47.67 U4.37
RS485A
  Top 0.254: J9.2 9.61,59.18 R40.2 11.09,58.76 11.43,58.42 11.43,56.01 10.54,55.12 U9.6
RS485B
  Top 0.254: R40.1 9.65,56.68 9.27,56.68 | 9.27,56.68 4.36,56.68 | U9.7 9.27,56.68
  Top 0.406: 4.36,56.68 J9.1
SCK
  Top 0.178: X3.15 47.33,9.52 43.69,13.16 41.91,13.16 41.78,13.16 33.78,13.16 32.89,14.05 32.89,35.72 28.48,40.13 U4.24
SCL
  Top 0.178: U4.19 25.74,33.81 27.48,33.81 30.5,30.79 30.5,13.06 32.64,10.92 41.58,10.92 42.83,9.68 X3.6 42.82,1.62 42.13,0.94 32.39,0.94 31.37,1.95 R7.1 31.37,3.61
SDA
  Top 0.178: U4.18 25.8,32.42 27.5,32.42 30.07,29.85 30.07,12.75 32.36,10.46 41.43,10.46 42.33,9.57 X3.5 42.33,1.94 41.88,1.49 34.45,1.49 33.78,2.16 R8.1 33.78,3.68
TE
  Top 0.178: U4.15 27.61,28.7 29.21,27.11 29.21,12.19 31.88,9.53 41.02,9.53 41.33,9.22 X3.3
TS1_W
  Top 0.254: R31.2 52.64,51.54 67.84,51.54 69.85,49.53 J6.8
TS1_W_IO
  Top 0.191: U13.16 45.09,69.32 43.31,67.54 U2.13
TS1_Y
  Top 0.254: R30.2 57.14,52.12 73.61,52.12 J6.7
TS1_Y_IO
  Top 0.191: U13.14 52.07,67.31 50.42,65.66 44.45,65.66 43.71,64.92 U2.12
TS2_W
  Top 0.254: R29.2 61,53.34 68.07,53.34 69.34,54.61 69.34,57.91 71.12,59.69 J6.4
TS2_W_IO
  Top 0.191: U2.11 44.11,64.43 44.83,65.15 55.37,65.15 57.15,66.93 U13.12
TS2_Y
  Top 0.254: R28.2 64.81,54.61 67.31,54.61 68.07,55.37 68.07,60.45 69.85,62.23 J6.3
TS2_Y_IO
  Top 0.191: U2.14 42.91,68.31 46.1,71.5 60.96,71.5 61.09,71.5 61.85,71.5 62.23,71.12 U13.10
TS3_W
  Top 0.254: R35.2 62.74,82.04 63.12,81.66 65.66,81.66 69.85,77.47 69.85,74.93 72.39,72.39 J7.8
TS3_W_IO
  Top 0.191: U2.15 42.51,68.67 45.85,72.01 54.61,72.01 55.88,73.28 U14.16
TS4_W
  Top 0.254: R34.2 73.24,82.97 J7.4
TS4_W_IO
  Top 0.191: U2.16 41.81,68.73 45.72,72.64 50.16,72.64 50.8,73.28 U14.14
TS_INT
  Top 0.178: U4.17 27.43,31.24 29.64,29.03 29.64,12.45 32.05,10.03 41.25,10.03 41.83,9.46 X3.4
UART
  Top 0.191: U2.20 | U2.20 40.98,53.68 40.64,53.34 40.64,43.94 39.88,43.18 UART.TP
  Top 0.254: U4.28 23.19,45.67 23.62,46.1 30.1,46.1 33.02,43.18 UART.TP
UPDI
  Top 0.191: U2.19 40.75,54.08 38.86,52.2 J12.1
USB_D+  (via drill 0.35)
  Top 0.254: J1.A6 9.53,18.03 10.16,17.39 v10.16,17.02 v10.16,17.03 J1.B6 | U4.14 24.26,27.14 24.26,28.57 v23.37,29.46
  Bottom 0.254: v10.16,17.02 10.41,17.02 12.95,19.56 18.54,19.56 23.37,24.38 v23.37,29.46
USB_D-  (via drill 0.35)
  Top 0.254: J1.A7 7.36,17.53 7.24,17.65 7.24,18.41 7.35,18.53 J1.B7 10.15,18.53 v10.16,18.54 | v21.97,29.34 21.97,29.21 23.19,27.99 U4.13
  Bottom 0.254: v10.16,18.54 12.39,20.78 17.97,20.78 21.97,24.78 v21.97,29.34
V_USB
  Top 0.254: 9.65,15.33 11.09,15.33 11.18,15.24
  Top 0.305: J1.VBUS2 9.65,15.33 | J1.VBUS1 9.74,20.23 11.18,18.8 11.18,15.24 11.18,11.43 13.08,9.53 13.08,6.99 13.6,6.47 D1.A
VIN
  Top 0.305: D4.A 21.33,2.02 X1.1
VLV1/2_SW
  Top 0.203: D2.A D5.C
  Top 0.254: R33.2 15.49,98.42 D5.C
VLV1/2_SW_IO  (via drill 0.35)
  Top 0.191: U2.17 40.88,54.88 40.51,55.24 v40.51,56.77 40.51,68.2 45.72,73.41 U14.12 | v39.75,54.23 38.86,53.34 36.83,53.34 36.32,52.83 R2.1
  Bottom 0.254: v39.75,54.23 39.75,56.01 v40.51,56.77
VLV1_M
  Top 0.762: RV1.2 10.39,63.27
  Top 1.016: 10.39,63.27 6.99,66.67 J2.1
  pour Top (isolate 0.381): 10.41,63.75 19.68,63.75 19.68,62.36 18.67,61.34 11.43,61.34 10.41,62.36
VLV1_O
  Top 0.203: 16.84,45.52 16.84,46.03 16,46.86 R10.2
  Top 0.254: U4.33 16.84,45.52
VLV1_SW
  Top 0.203: J2.4 1.4,74.3 0.74,74.95 0.74,110.87 1.14,111.28 6.35,111.28 9.4,108.23 9.4,105.28 11.81,102.87 16.89,102.87 17.65,102.11 D2.C
VLV2_M
  Top 0.762: RV2.1 13.74,73.89
  Top 1.016: J2.5 4.29,76.81 7.75,76.81 10.67,73.89 RV2.1
  pour Top (isolate 0.381): 10.41,75.69 19.68,75.69 19.68,73.28 10.41,73.28
VLV2_O
  Top 0.254: U4.32 18.03,44.44 R4.2
VLV2_SW
  Top 0.203: J2.8 2.54,84.45 1.37,85.62 1.37,110.4 1.69,110.72 6.22,110.72 8.94,108 8.94,105.15 11.67,102.41 14.62,102.41 15.37,101.67 D5.A
VLV3/4_SW
  Top 0.203: D6.A 13.08,98.55 D3.C | 12.83,95.89 R32.2
  Top 0.254: R32.2 12.83,98.42 D3.C
VLV3/4_SW_IO
  Top 0.191: U2.18 40.72,54.48 39.62,55.58 | 39.62,55.58 39.62,72.64 40.64,73.66 U14.10 | 33.78,52.32 R1.1 33.78,53.34 35.05,54.61 38.66,54.61 39.62,55.58
VLV3_M
  Top 0.762: 12.92,78.54 13.94,78.54 RV3.2 10.64,78.51
  Top 1.016: J3.1 8.13,86.74 8.13,81.03 10.64,78.51
  pour Top (isolate 0.381): 10.41,78.99 19.68,78.99 19.68,76.83 10.41,76.83
VLV3_O
  Top 0.254: R5.2 20.19,46.98 19.38,46.34 U4.31
VLV3_SW
  Top 0.203: J3.4 2.54,98.3 1.83,99.01 1.83,109.97 2.16,110.3 5.97,110.3 8.48,107.79 8.48,104.88 11.41,101.96 12.72,101.96 13.08,101.6 D3.A
VLV4_M
  Top 0.191: RV4.1 13.97,89.26 13.97,90.17 13.59,90.55 12.19,90.55
  Top 1.016: J3.5 5.84,100.84 9.53,97.16 9.53,93.22 12.19,90.55
  pour Top (isolate 0.381): 11.68,90.81 18.41,90.81 19.68,89.53 19.68,88.52 12.32,88.52 11.68,89.15
VLV4_O
  Top 0.254: R6.2 20.65,45.45 U4.30
VLV4_SW
  Top 0.203: J3.8 6.99,108.46 8,107.44 8,104.71 10.67,102.05 D6.C

### Text on the board
tNames: GND | 3.3V | UPDI
Document: TOP
tDocu: DISP